# Altium schematic sheet 小车.SchDoc
size A4
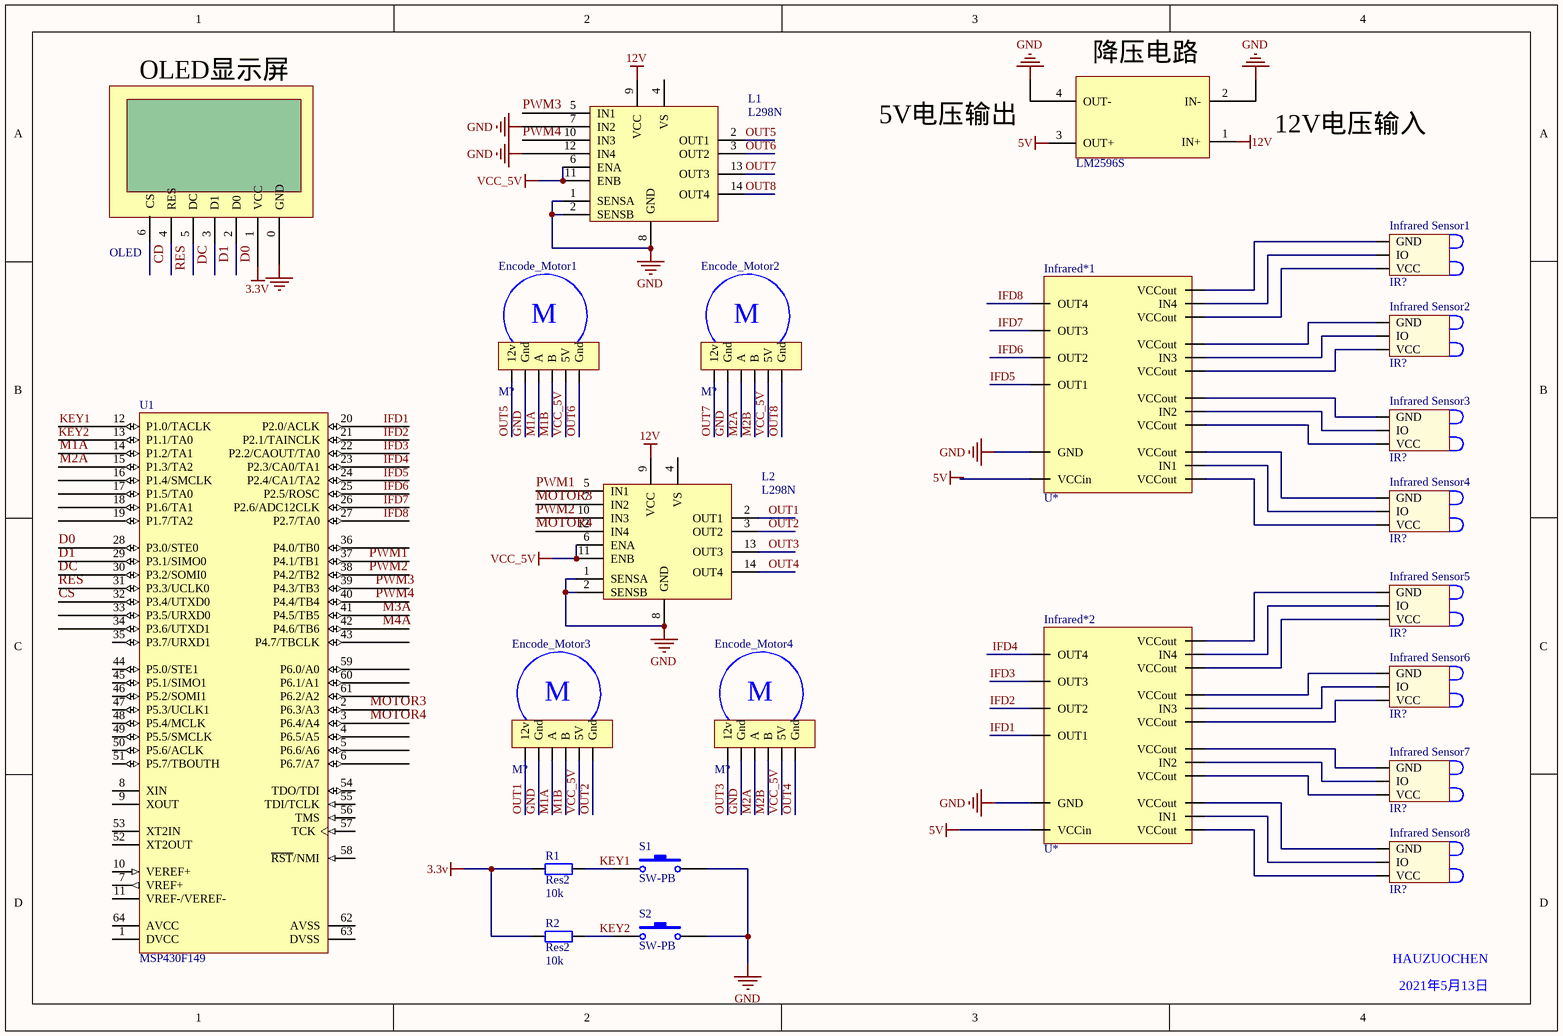
[diagram p0: 小车.SchDoc]

## Parts
1  LM2596S
2  OLED
Encode_Motor1  M?
Encode_Motor2  M?
Encode_Motor3  M?
Encode_Motor4  M?
Infrared*1  U*
Infrared*2  U*
Infrared_Sensor1  IR?
Infrared_Sensor2  IR?
Infrared_Sensor3  IR?
Infrared_Sensor4  IR?
Infrared_Sensor5  IR?
Infrared_Sensor6  IR?
Infrared_Sensor7  IR?
Infrared_Sensor8  IR?
L1  L298N
L2  L298N
R1  Res2  value 10k  [AXIAL-0.4]
R2  Res2  value 10k  [AXIAL-0.4]
S1  SW-PB  [SPST-2]
S2  SW-PB  [SPST-2]
U1  MSP430F149  [TI-PAG64_N]

## Nets
3.3V: 2.1(VCC) R1.2 R2.2
5V: 1.3(OUT+) Infrared*2.0(VCCin)
12V: 1.1(IN+) L1.9(VCC) L2.9(VCC)
GND: 1.2(IN-) 1.4(OUT-) 2.0(GND) Encode_Motor1.16(Gnd) Encode_Motor2.16(Gnd) Encode_Motor3.16(Gnd) Encode_Motor4.16(Gnd) Infrared*1.1(GND) Infrared*2.1(GND) L1.1(SENSA) L1.2(SENSB) L1.7(IN2) L1.8(GND) L1.12(IN4) L2.1(SENSA) L2.2(SENSB) L2.8(GND) S1.2 S2.2
VCC_5V: Encode_Motor1.19(5V) Encode_Motor2.19(5V) Encode_Motor3.19(5V) Encode_Motor4.19(5V) L1.6(ENA) L1.11(ENB) L2.6(ENA) L2.11(ENB)
CD: 2.6(CS)
CS: U1.32(P3.4/UTXD0)
D0: 2.2(D0) U1.28(P3.0/STE0)
D1: 2.3(D1) U1.29(P3.1/SIMO0)
DC: 2.5(DC) U1.30(P3.2/SOMI0)
IFD1: Infrared*2.2(OUT1) U1.20(P2.0/ACLK)
IFD2: Infrared*2.3(OUT2) U1.21(P2.1/TAINCLK)
IFD3: Infrared*2.4(OUT3) U1.22(P2.2/CAOUT/TA0)
IFD4: Infrared*2.5(OUT4) U1.23(P2.3/CA0/TA1)
IFD5: Infrared*1.2(OUT1) U1.24(P2.4/CA1/TA2)
IFD6: Infrared*1.3(OUT2) U1.25(P2.5/ROSC)
IFD7: Infrared*1.4(OUT3) U1.26(P2.6/ADC12CLK)
IFD8: Infrared*1.5(OUT4) U1.27(P2.7/TA0)
KEY1: R1.1 S1.1 U1.12(P1.0/TACLK)
KEY2: R2.1 S2.1 U1.13(P1.1/TA0)
M1A: Encode_Motor1.17(A) Encode_Motor3.17(A) U1.14(P1.2/TA1)
M1B: Encode_Motor1.18(B) Encode_Motor3.18(B)
M2A: Encode_Motor2.17(A) Encode_Motor4.17(A) U1.15(P1.3/TA2)
M2B: Encode_Motor2.18(B) Encode_Motor4.18(B)
M3A: U1.41(P4.5/TB5)
M4A: U1.42(P4.6/TB6)
MOTOR3: L2.7(IN2) U1.2(P6.3/A3)
MOTOR4: L2.12(IN4) U1.3(P6.4/A4)
OUT1: Encode_Motor3.15(12v) L2.2(OUT1)
OUT2: Encode_Motor3.20(Gnd) L2.3(OUT2)
OUT3: Encode_Motor4.15(12v) L2.13(OUT3)
OUT4: Encode_Motor4.20(Gnd) L2.14(OUT4)
OUT5: Encode_Motor1.15(12v) L1.2(OUT1)
OUT6: Encode_Motor1.20(Gnd) L1.3(OUT2)
OUT7: Encode_Motor2.15(12v) L1.13(OUT3)
OUT8: Encode_Motor2.20(Gnd) L1.14(OUT4)
PWM1: L2.5(IN1) U1.37(P4.1/TB1)
PWM2: L2.10(IN3) U1.38(P4.2/TB2)
PWM3: L1.5(IN1) U1.39(P4.3/TB3)
PWM4: L1.10(IN3) U1.40(P4.4/TB4)
RES: 2.4(RES) U1.31(P3.3/UCLK0)
NetInfrared*1_6: Infrared*1.6(IN1) Infrared_Sensor4.22(IO)
NetInfrared*1_7: Infrared*1.7(IN2) Infrared_Sensor3.22(IO)
NetInfrared*1_8: Infrared*1.8(IN3) Infrared_Sensor2.22(IO)
NetInfrared*1_9: Infrared*1.9(IN4) Infrared_Sensor1.22(IO)
NetInfrared*1_10: Infrared*1.10(VCCout) Infrared_Sensor4.23(VCC)
NetInfrared*1_11: Infrared*1.11(VCCout) Infrared_Sensor4.21(GND)
NetInfrared*1_12: Infrared*1.12(VCCout) Infrared_Sensor3.23(VCC)
NetInfrared*1_13: Infrared*1.13(VCCout) Infrared_Sensor3.21(GND)
NetInfrared*1_14: Infrared*1.14(VCCout) Infrared_Sensor2.23(VCC)
NetInfrared*1_15: Infrared*1.15(VCCout) Infrared_Sensor2.21(GND)
NetInfrared*1_16: Infrared*1.16(VCCout) Infrared_Sensor1.23(VCC)
NetInfrared*1_17: Infrared*1.17(VCCout) Infrared_Sensor1.21(GND)
NetInfrared*2_6: Infrared*2.6(IN1) Infrared_Sensor8.22(IO)
NetInfrared*2_7: Infrared*2.7(IN2) Infrared_Sensor7.22(IO)
NetInfrared*2_8: Infrared*2.8(IN3) Infrared_Sensor6.22(IO)
NetInfrared*2_9: Infrared*2.9(IN4) Infrared_Sensor5.22(IO)
NetInfrared*2_10: Infrared*2.10(VCCout) Infrared_Sensor8.23(VCC)
NetInfrared*2_11: Infrared*2.11(VCCout) Infrared_Sensor8.21(GND)
NetInfrared*2_12: Infrared*2.12(VCCout) Infrared_Sensor7.23(VCC)
NetInfrared*2_13: Infrared*2.13(VCCout) Infrared_Sensor7.21(GND)
NetInfrared*2_14: Infrared*2.14(VCCout) Infrared_Sensor6.23(VCC)
NetInfrared*2_15: Infrared*2.15(VCCout) Infrared_Sensor6.21(GND)
NetInfrared*2_16: Infrared*2.16(VCCout) Infrared_Sensor5.23(VCC)
NetInfrared*2_17: Infrared*2.17(VCCout) Infrared_Sensor5.21(GND)

Not connected (* = marked no-connect by the designer): Infrared*1 0(VCCin); L1 4(VS); L2 4(VS); U1 1(DVCC) 4(P6.5/A5) 5(P6.6/A6) 6(P6.7/A7) 7(VREF+) 8(XIN) 9(XOUT) 10(VEREF+) 11(VREF-/VEREF-) 16(P1.4/SMCLK) 17(P1.5/TA0) 18(P1.6/TA1) 19(P1.7/TA2) 33(P3.5/URXD0) 34(P3.6/UTXD1) 35(P3.7/URXD1) 36(P4.0/TB0) 43(P4.7/TBCLK) 44(P5.0/STE1) 45(P5.1/SIMO1) 46(P5.2/SOMI1) 47(P5.3/UCLK1) 48(P5.4/MCLK) 49(P5.5/SMCLK) 50(P5.6/ACLK) 51(P5.7/TBOUTH) 52(XT2OUT) 53(XT2IN) 54(TDO/TDI) 55(TDI/TCLK) 56(TMS) 57(TCK) 58(~{RST}/NMI) 59(P6.0/A0) 60(P6.1/A1) 61(P6.2/A2) 62(AVSS) 63(DVSS) 64(AVCC)

## Notes on the sheet
- OLED显示屏
- (near 1) 降压电路
- 5V电压输出
- 12V电压输入
- HAUZUOCHEN
- 2021年5月13日
- Labels drawn without touching a wire or pin: 5V
- Title
- Size:
- Date:
- A4
- Number:
- Time:
- Revision:
- Sheet
- of
- File:
- (in symbol Encode_Motor) M

## Library data of the parts
Encode_Motor1-Encode_Motor4 = Encode_Motor
Infrared*1 Infrared*2 = infrared-sensor-dirve
Infrared_Sensor1-Infrared_Sensor8 = Infrared Sensor
L1 L2 = L298N_
R1 R2 = Res2: Resistor; Published: 8-Jun-2000; LatestRevisionDate: 17-Jul-2002; LatestRevisionNote: Re-released for DXP Platform.; PackageReference: AXIAL-0.4; Publisher: Altium Limited; PackageDescription: Axial Device, Thru-Hole; 2 Leads; 0.4 in Pin Spacing
S1 S2 = SW-PB: Switch; Published: 24-Mar-1999; LatestRevisionDate: 17-Jul-2002; LatestRevisionNote: Re-released for DXP Platform.; PackageReference: SPST-2; Publisher: Altium Limited; PackageDescription: Switch; 2 Leads
U1 = MSP430F149IPAGR: 8 MHz Mixed Signal Microcontroller with 60 KB Flash, 2048 B SRAM and 48 GPIOs, -40 to 85 degC, 64-pin QFP (PAG), Green (RoHS & no Sb/Br); Manufacturer: Texas Instruments; ADC: 12-bit SAR; ADC Channels: 8; Comparators: Yes; Flash(KB): 60; GPIO: 48; Multiplier: 16x16; SRAM(B): 2048; SubFamily: 1 Series; Timers - 16-bit: 2; DatasheetVersion: SLAS272F; PackageVersion: 4040282/C; PackageReference: PAG64; PackageDescription: 64-Pin Plastic Flat Pack, Body 10.00 x 10.00 mm, Pitch 0.50 mm; Supplier 1: Digi-Key; Supplier Part Number 1: 296-13102-ND; Supplier 2: Farnell; Supplier Part Number 2: 1470495; Supplier 3: Newark; Supplier Part Number 3: 75C4041; Supplier 4: Mouser; Supplier Part Number 4: 595-430F149IPAG; Eco-Plan: Green (RoHS & no Sb/Br); Frequency(MHz): 8; Temp Sensor: Yes; USART: 2; Watchdog: Yes; Mounting Technology: Surface Mount; Code_JEDEC: MS-026; PartNumber: MSP430F149IPAGR; ComponentLink1Description: Manufacturer URL; ComponentLink1URL: http://www.ti.com/; ComponentLink2Description: Datasheet; ComponentLink2URL: http://www.ti.com/general/docs/lit/getliterature.tsp?genericPartNumber=MSP430F149&fileType=pdf; ComponentLink3Description: Package Specification; ComponentLink3URL: http://www.ti.com/lit/ml/mtqf006a/mtqf006a.pdf